# Altium schematic sheet Schematic1.SchDoc
size A0; SheetNumber: 1; SheetTotal: 1
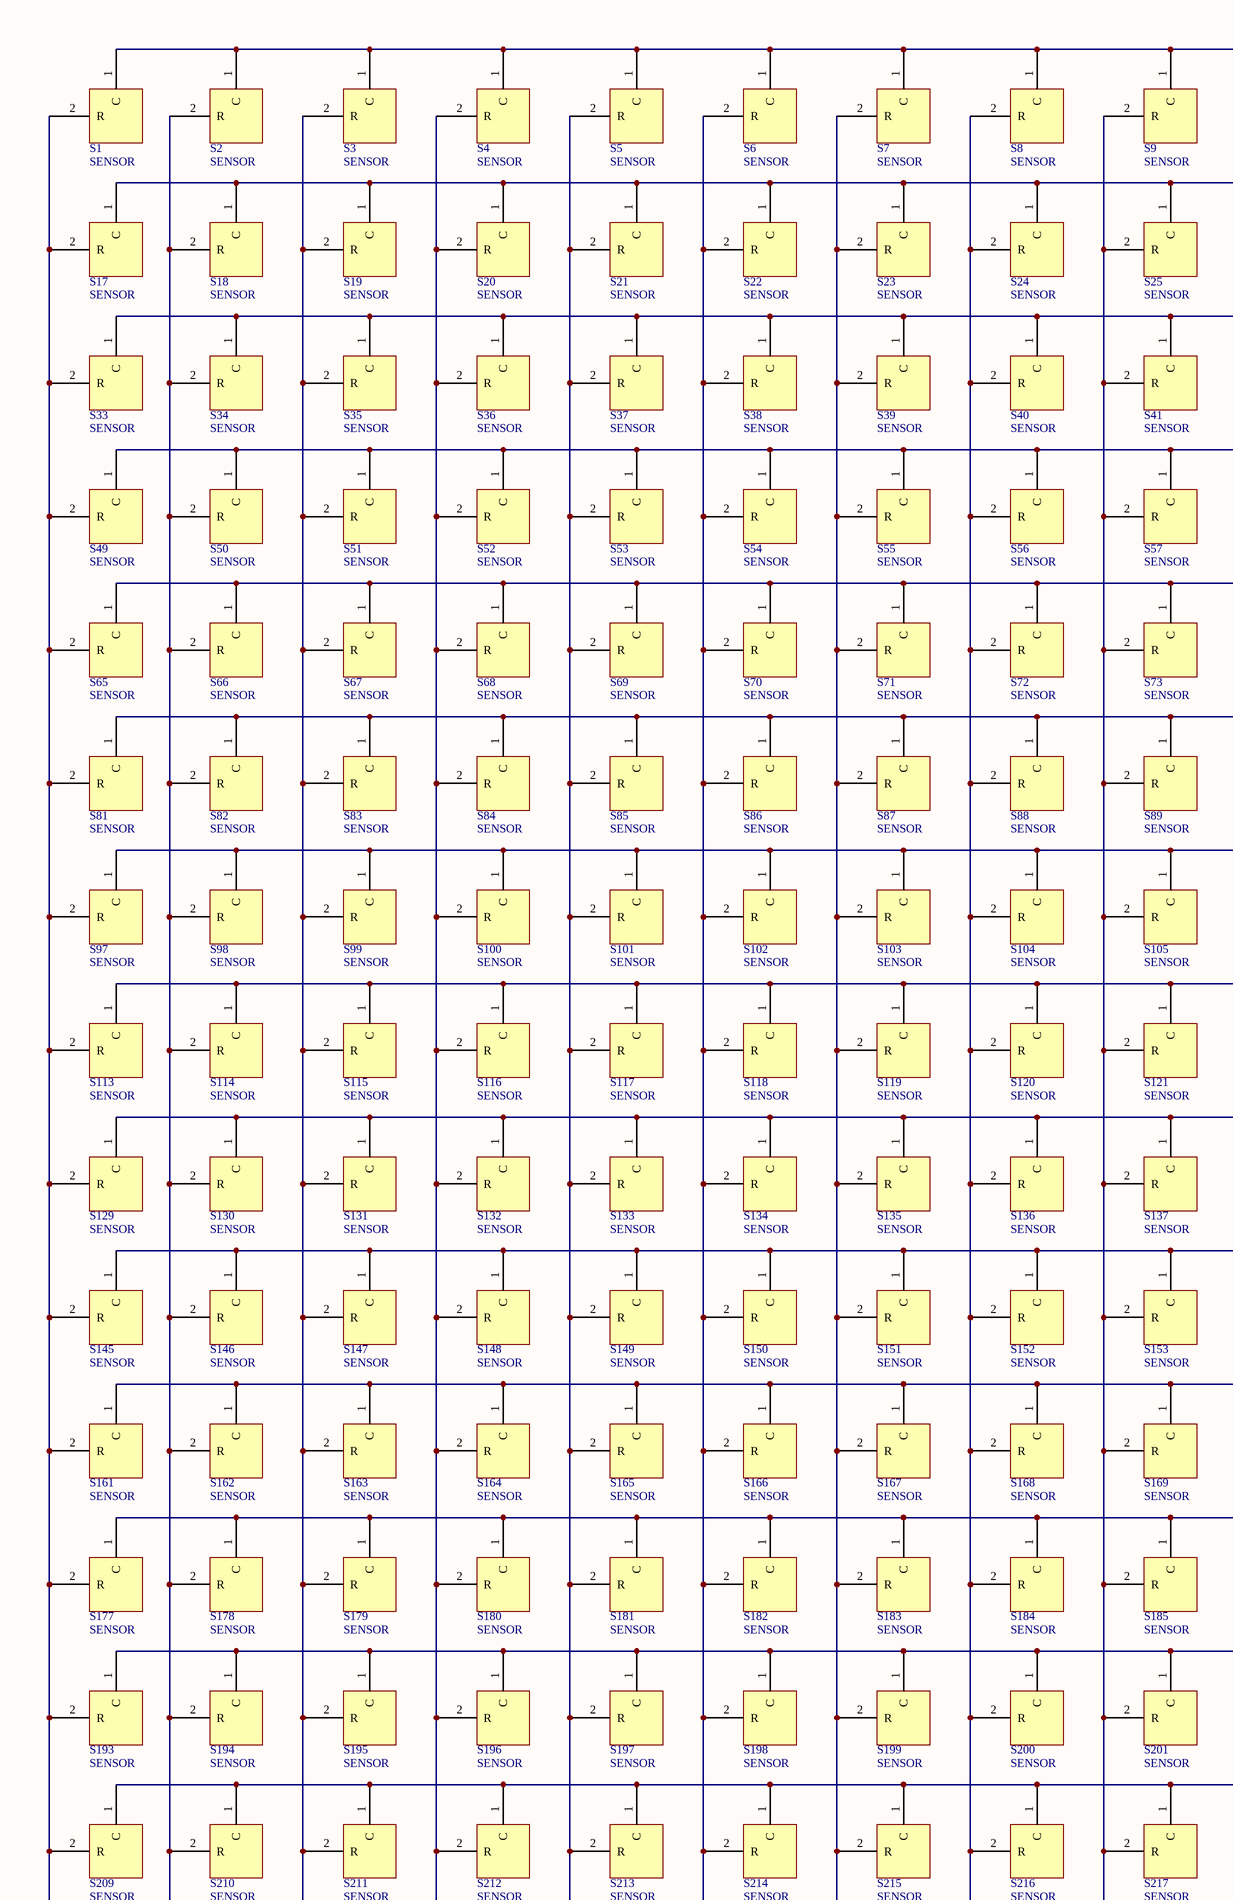
[diagram p0: Schematic1.SchDoc, top left]
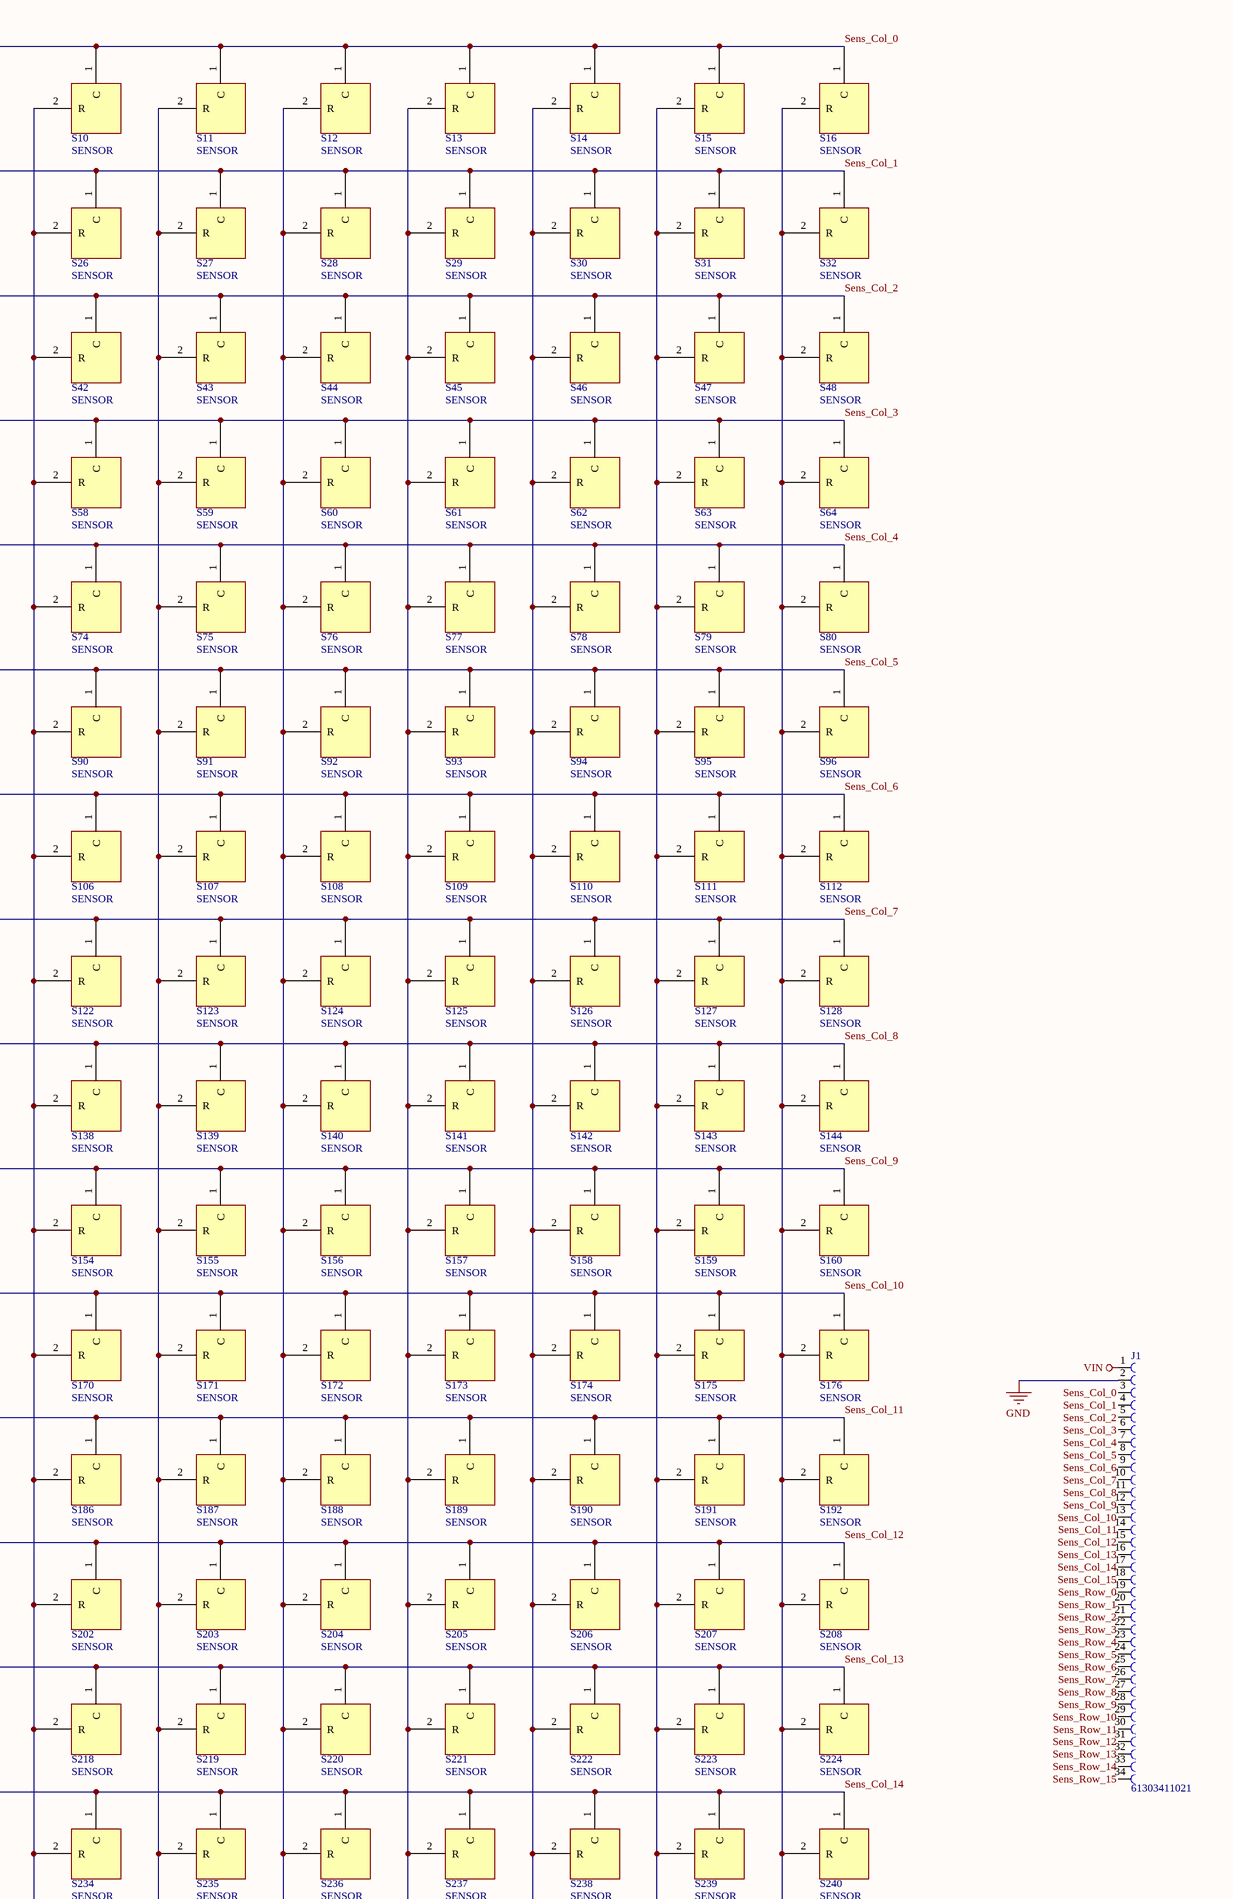
[diagram p1: Schematic1.SchDoc, top right]
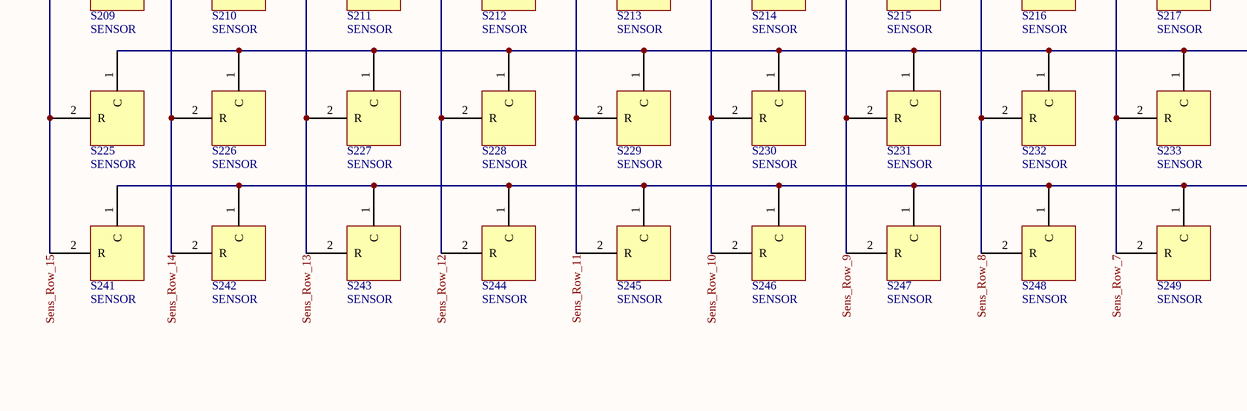
[diagram p2: Schematic1.SchDoc, bottom left]
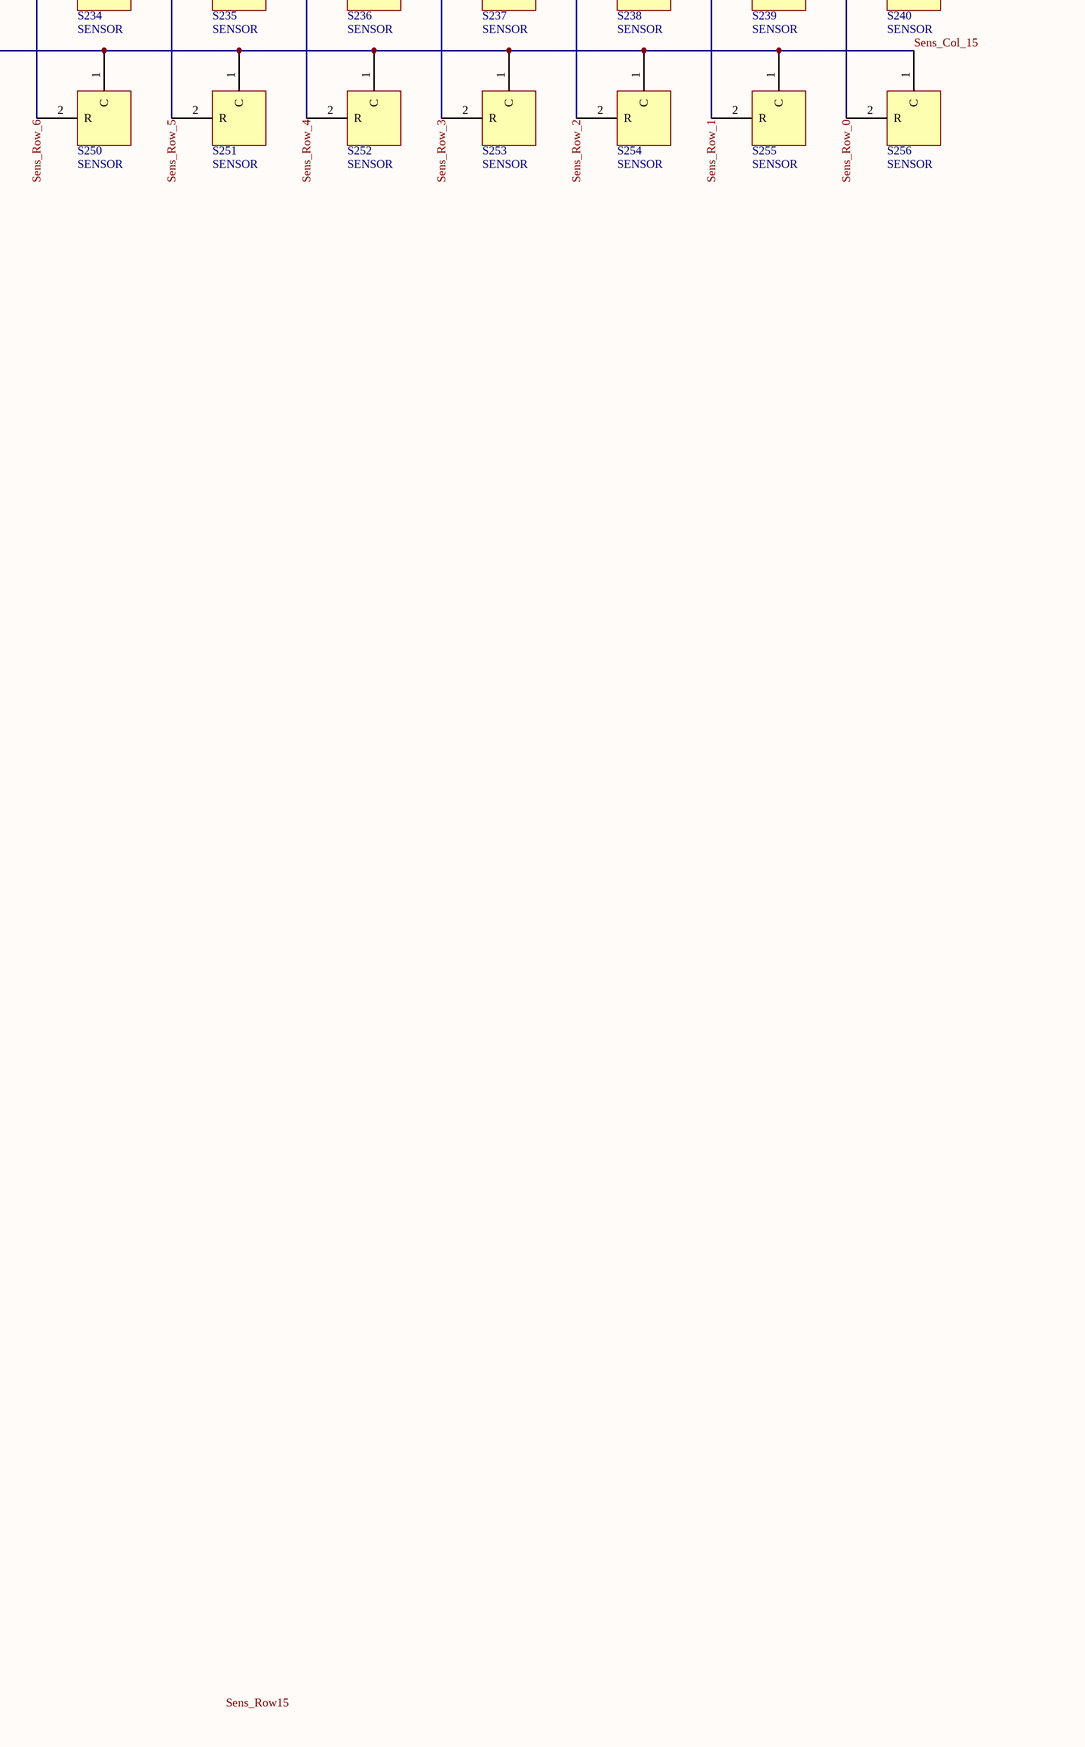
[diagram p3: Schematic1.SchDoc, bottom right]

## Parts
J1  61303411021  [61303411021]
S1  SENSOR  [SENSOR]
S2  SENSOR  [SENSOR]
S3  SENSOR  [SENSOR]
S4  SENSOR  [SENSOR]
S5  SENSOR  [SENSOR]
S6  SENSOR  [SENSOR]
S7  SENSOR  [SENSOR]
S8  SENSOR  [SENSOR]
S9  SENSOR  [SENSOR]
S10  SENSOR  [SENSOR]
S11  SENSOR  [SENSOR]
S12  SENSOR  [SENSOR]
S13  SENSOR  [SENSOR]
S14  SENSOR  [SENSOR]
S15  SENSOR  [SENSOR]
S16  SENSOR  [SENSOR]
S17  SENSOR  [SENSOR]
S18  SENSOR  [SENSOR]
S19  SENSOR  [SENSOR]
S20  SENSOR  [SENSOR]
S21  SENSOR  [SENSOR]
S22  SENSOR  [SENSOR]
S23  SENSOR  [SENSOR]
S24  SENSOR  [SENSOR]
S25  SENSOR  [SENSOR]
S26  SENSOR  [SENSOR]
S27  SENSOR  [SENSOR]
S28  SENSOR  [SENSOR]
S29  SENSOR  [SENSOR]
S30  SENSOR  [SENSOR]
S31  SENSOR  [SENSOR]
S32  SENSOR  [SENSOR]
S33  SENSOR  [SENSOR]
S34  SENSOR  [SENSOR]
S35  SENSOR  [SENSOR]
S36  SENSOR  [SENSOR]
S37  SENSOR  [SENSOR]
S38  SENSOR  [SENSOR]
S39  SENSOR  [SENSOR]
S40  SENSOR  [SENSOR]
S41  SENSOR  [SENSOR]
S42  SENSOR  [SENSOR]
S43  SENSOR  [SENSOR]
S44  SENSOR  [SENSOR]
S45  SENSOR  [SENSOR]
S46  SENSOR  [SENSOR]
S47  SENSOR  [SENSOR]
S48  SENSOR  [SENSOR]
S49  SENSOR  [SENSOR]
S50  SENSOR  [SENSOR]
S51  SENSOR  [SENSOR]
S52  SENSOR  [SENSOR]
S53  SENSOR  [SENSOR]
S54  SENSOR  [SENSOR]
S55  SENSOR  [SENSOR]
S56  SENSOR  [SENSOR]
S57  SENSOR  [SENSOR]
S58  SENSOR  [SENSOR]
S59  SENSOR  [SENSOR]
S60  SENSOR  [SENSOR]
S61  SENSOR  [SENSOR]
S62  SENSOR  [SENSOR]
S63  SENSOR  [SENSOR]
S64  SENSOR  [SENSOR]
S65  SENSOR  [SENSOR]
S66  SENSOR  [SENSOR]
S67  SENSOR  [SENSOR]
S68  SENSOR  [SENSOR]
S69  SENSOR  [SENSOR]
S70  SENSOR  [SENSOR]
S71  SENSOR  [SENSOR]
S72  SENSOR  [SENSOR]
S73  SENSOR  [SENSOR]
S74  SENSOR  [SENSOR]
S75  SENSOR  [SENSOR]
S76  SENSOR  [SENSOR]
S77  SENSOR  [SENSOR]
S78  SENSOR  [SENSOR]
S79  SENSOR  [SENSOR]
S80  SENSOR  [SENSOR]
S81  SENSOR  [SENSOR]
S82  SENSOR  [SENSOR]
S83  SENSOR  [SENSOR]
S84  SENSOR  [SENSOR]
S85  SENSOR  [SENSOR]
S86  SENSOR  [SENSOR]
S87  SENSOR  [SENSOR]
S88  SENSOR  [SENSOR]
S89  SENSOR  [SENSOR]
S90  SENSOR  [SENSOR]
S91  SENSOR  [SENSOR]
S92  SENSOR  [SENSOR]
S93  SENSOR  [SENSOR]
S94  SENSOR  [SENSOR]
S95  SENSOR  [SENSOR]
S96  SENSOR  [SENSOR]
S97  SENSOR  [SENSOR]
S98  SENSOR  [SENSOR]
S99  SENSOR  [SENSOR]
S100  SENSOR  [SENSOR]
S101  SENSOR  [SENSOR]
S102  SENSOR  [SENSOR]
S103  SENSOR  [SENSOR]
S104  SENSOR  [SENSOR]
S105  SENSOR  [SENSOR]
S106  SENSOR  [SENSOR]
S107  SENSOR  [SENSOR]
S108  SENSOR  [SENSOR]
S109  SENSOR  [SENSOR]
S110  SENSOR  [SENSOR]
S111  SENSOR  [SENSOR]
S112  SENSOR  [SENSOR]
S113  SENSOR  [SENSOR]
S114  SENSOR  [SENSOR]
S115  SENSOR  [SENSOR]
S116  SENSOR  [SENSOR]
S117  SENSOR  [SENSOR]
S118  SENSOR  [SENSOR]
S119  SENSOR  [SENSOR]
S120  SENSOR  [SENSOR]
S121  SENSOR  [SENSOR]
S122  SENSOR  [SENSOR]
S123  SENSOR  [SENSOR]
S124  SENSOR  [SENSOR]
S125  SENSOR  [SENSOR]
S126  SENSOR  [SENSOR]
S127  SENSOR  [SENSOR]
S128  SENSOR  [SENSOR]
S129  SENSOR  [SENSOR]
S130  SENSOR  [SENSOR]
S131  SENSOR  [SENSOR]
S132  SENSOR  [SENSOR]
S133  SENSOR  [SENSOR]
S134  SENSOR  [SENSOR]
S135  SENSOR  [SENSOR]
S136  SENSOR  [SENSOR]
S137  SENSOR  [SENSOR]
S138  SENSOR  [SENSOR]
S139  SENSOR  [SENSOR]
S140  SENSOR  [SENSOR]
S141  SENSOR  [SENSOR]
S142  SENSOR  [SENSOR]
S143  SENSOR  [SENSOR]
S144  SENSOR  [SENSOR]
S145  SENSOR  [SENSOR]
S146  SENSOR  [SENSOR]
S147  SENSOR  [SENSOR]
S148  SENSOR  [SENSOR]
S149  SENSOR  [SENSOR]
S150  SENSOR  [SENSOR]
S151  SENSOR  [SENSOR]
S152  SENSOR  [SENSOR]
S153  SENSOR  [SENSOR]
S154  SENSOR  [SENSOR]
S155  SENSOR  [SENSOR]
S156  SENSOR  [SENSOR]
S157  SENSOR  [SENSOR]
S158  SENSOR  [SENSOR]
S159  SENSOR  [SENSOR]
S160  SENSOR  [SENSOR]
S161  SENSOR  [SENSOR]
S162  SENSOR  [SENSOR]
S163  SENSOR  [SENSOR]
S164  SENSOR  [SENSOR]
S165  SENSOR  [SENSOR]
S166  SENSOR  [SENSOR]
S167  SENSOR  [SENSOR]
S168  SENSOR  [SENSOR]
S169  SENSOR  [SENSOR]
S170  SENSOR  [SENSOR]
S171  SENSOR  [SENSOR]
S172  SENSOR  [SENSOR]
S173  SENSOR  [SENSOR]
S174  SENSOR  [SENSOR]
S175  SENSOR  [SENSOR]
S176  SENSOR  [SENSOR]
S177  SENSOR  [SENSOR]
S178  SENSOR  [SENSOR]
S179  SENSOR  [SENSOR]
S180  SENSOR  [SENSOR]
S181  SENSOR  [SENSOR]
S182  SENSOR  [SENSOR]
S183  SENSOR  [SENSOR]
S184  SENSOR  [SENSOR]
S185  SENSOR  [SENSOR]
S186  SENSOR  [SENSOR]
S187  SENSOR  [SENSOR]
S188  SENSOR  [SENSOR]
S189  SENSOR  [SENSOR]
S190  SENSOR  [SENSOR]
S191  SENSOR  [SENSOR]
S192  SENSOR  [SENSOR]
S193  SENSOR  [SENSOR]
S194  SENSOR  [SENSOR]
S195  SENSOR  [SENSOR]
S196  SENSOR  [SENSOR]
S197  SENSOR  [SENSOR]
S198  SENSOR  [SENSOR]
S199  SENSOR  [SENSOR]
S200  SENSOR  [SENSOR]
S201  SENSOR  [SENSOR]
S202  SENSOR  [SENSOR]
S203  SENSOR  [SENSOR]
S204  SENSOR  [SENSOR]
S205  SENSOR  [SENSOR]
S206  SENSOR  [SENSOR]
S207  SENSOR  [SENSOR]
S208  SENSOR  [SENSOR]
S209  SENSOR  [SENSOR]
S210  SENSOR  [SENSOR]
S211  SENSOR  [SENSOR]
S212  SENSOR  [SENSOR]
S213  SENSOR  [SENSOR]
S214  SENSOR  [SENSOR]
S215  SENSOR  [SENSOR]
S216  SENSOR  [SENSOR]
S217  SENSOR  [SENSOR]
S218  SENSOR  [SENSOR]
S219  SENSOR  [SENSOR]
S220  SENSOR  [SENSOR]
S221  SENSOR  [SENSOR]
S222  SENSOR  [SENSOR]
S223  SENSOR  [SENSOR]
S224  SENSOR  [SENSOR]
S225  SENSOR  [SENSOR]
S226  SENSOR  [SENSOR]
S227  SENSOR  [SENSOR]
S228  SENSOR  [SENSOR]
S229  SENSOR  [SENSOR]
S230  SENSOR  [SENSOR]
S231  SENSOR  [SENSOR]
S232  SENSOR  [SENSOR]
S233  SENSOR  [SENSOR]
S234  SENSOR  [SENSOR]
S235  SENSOR  [SENSOR]
S236  SENSOR  [SENSOR]
S237  SENSOR  [SENSOR]
S238  SENSOR  [SENSOR]
S239  SENSOR  [SENSOR]
S240  SENSOR  [SENSOR]
S241  SENSOR  [SENSOR]
S242  SENSOR  [SENSOR]
S243  SENSOR  [SENSOR]
S244  SENSOR  [SENSOR]
S245  SENSOR  [SENSOR]
S246  SENSOR  [SENSOR]
S247  SENSOR  [SENSOR]
S248  SENSOR  [SENSOR]
S249  SENSOR  [SENSOR]
S250  SENSOR  [SENSOR]
S251  SENSOR  [SENSOR]
S252  SENSOR  [SENSOR]
S253  SENSOR  [SENSOR]
S254  SENSOR  [SENSOR]
S255  SENSOR  [SENSOR]
S256  SENSOR  [SENSOR]

## Nets
GND: J1.2
VIN: J1.1
Sens_Col_0: J1.3 S1.1(C) S2.1(C) S3.1(C) S4.1(C) S5.1(C) S6.1(C) S7.1(C) S8.1(C) S9.1(C) S10.1(C) S11.1(C) S12.1(C) S13.1(C) S14.1(C) S15.1(C) S16.1(C)
Sens_Col_1: J1.4 S17.1(C) S18.1(C) S19.1(C) S20.1(C) S21.1(C) S22.1(C) S23.1(C) S24.1(C) S25.1(C) S26.1(C) S27.1(C) S28.1(C) S29.1(C) S30.1(C) S31.1(C) S32.1(C)
Sens_Col_2: J1.5 S33.1(C) S34.1(C) S35.1(C) S36.1(C) S37.1(C) S38.1(C) S39.1(C) S40.1(C) S41.1(C) S42.1(C) S43.1(C) S44.1(C) S45.1(C) S46.1(C) S47.1(C) S48.1(C)
Sens_Col_3: J1.6 S49.1(C) S50.1(C) S51.1(C) S52.1(C) S53.1(C) S54.1(C) S55.1(C) S56.1(C) S57.1(C) S58.1(C) S59.1(C) S60.1(C) S61.1(C) S62.1(C) S63.1(C) S64.1(C)
Sens_Col_4: J1.7 S65.1(C) S66.1(C) S67.1(C) S68.1(C) S69.1(C) S70.1(C) S71.1(C) S72.1(C) S73.1(C) S74.1(C) S75.1(C) S76.1(C) S77.1(C) S78.1(C) S79.1(C) S80.1(C)
Sens_Col_5: J1.8 S81.1(C) S82.1(C) S83.1(C) S84.1(C) S85.1(C) S86.1(C) S87.1(C) S88.1(C) S89.1(C) S90.1(C) S91.1(C) S92.1(C) S93.1(C) S94.1(C) S95.1(C) S96.1(C)
Sens_Col_6: J1.9 S97.1(C) S98.1(C) S99.1(C) S100.1(C) S101.1(C) S102.1(C) S103.1(C) S104.1(C) S105.1(C) S106.1(C) S107.1(C) S108.1(C) S109.1(C) S110.1(C) S111.1(C) S112.1(C)
Sens_Col_7: J1.10 S113.1(C) S114.1(C) S115.1(C) S116.1(C) S117.1(C) S118.1(C) S119.1(C) S120.1(C) S121.1(C) S122.1(C) S123.1(C) S124.1(C) S125.1(C) S126.1(C) S127.1(C) S128.1(C)
Sens_Col_8: J1.11 S129.1(C) S130.1(C) S131.1(C) S132.1(C) S133.1(C) S134.1(C) S135.1(C) S136.1(C) S137.1(C) S138.1(C) S139.1(C) S140.1(C) S141.1(C) S142.1(C) S143.1(C) S144.1(C)
Sens_Col_9: J1.12 S145.1(C) S146.1(C) S147.1(C) S148.1(C) S149.1(C) S150.1(C) S151.1(C) S152.1(C) S153.1(C) S154.1(C) S155.1(C) S156.1(C) S157.1(C) S158.1(C) S159.1(C) S160.1(C)
Sens_Col_10: J1.13 S161.1(C) S162.1(C) S163.1(C) S164.1(C) S165.1(C) S166.1(C) S167.1(C) S168.1(C) S169.1(C) S170.1(C) S171.1(C) S172.1(C) S173.1(C) S174.1(C) S175.1(C) S176.1(C)
Sens_Col_11: J1.14 S177.1(C) S178.1(C) S179.1(C) S180.1(C) S181.1(C) S182.1(C) S183.1(C) S184.1(C) S185.1(C) S186.1(C) S187.1(C) S188.1(C) S189.1(C) S190.1(C) S191.1(C) S192.1(C)
Sens_Col_12: J1.15 S193.1(C) S194.1(C) S195.1(C) S196.1(C) S197.1(C) S198.1(C) S199.1(C) S200.1(C) S201.1(C) S202.1(C) S203.1(C) S204.1(C) S205.1(C) S206.1(C) S207.1(C) S208.1(C)
Sens_Col_13: J1.16 S209.1(C) S210.1(C) S211.1(C) S212.1(C) S213.1(C) S214.1(C) S215.1(C) S216.1(C) S217.1(C) S218.1(C) S219.1(C) S220.1(C) S221.1(C) S222.1(C) S223.1(C) S224.1(C)
Sens_Col_14: J1.17 S225.1(C) S226.1(C) S227.1(C) S228.1(C) S229.1(C) S230.1(C) S231.1(C) S232.1(C) S233.1(C) S234.1(C) S235.1(C) S236.1(C) S237.1(C) S238.1(C) S239.1(C) S240.1(C)
Sens_Col_15: J1.18 S241.1(C) S242.1(C) S243.1(C) S244.1(C) S245.1(C) S246.1(C) S247.1(C) S248.1(C) S249.1(C) S250.1(C) S251.1(C) S252.1(C) S253.1(C) S254.1(C) S255.1(C) S256.1(C)
Sens_Row_0: J1.19 S16.2(R) S32.2(R) S48.2(R) S64.2(R) S80.2(R) S96.2(R) S112.2(R) S128.2(R) S144.2(R) S160.2(R) S176.2(R) S192.2(R) S208.2(R) S224.2(R) S240.2(R) S256.2(R)
Sens_Row_1: J1.20 S15.2(R) S31.2(R) S47.2(R) S63.2(R) S79.2(R) S95.2(R) S111.2(R) S127.2(R) S143.2(R) S159.2(R) S175.2(R) S191.2(R) S207.2(R) S223.2(R) S239.2(R) S255.2(R)
Sens_Row_2: J1.21 S14.2(R) S30.2(R) S46.2(R) S62.2(R) S78.2(R) S94.2(R) S110.2(R) S126.2(R) S142.2(R) S158.2(R) S174.2(R) S190.2(R) S206.2(R) S222.2(R) S238.2(R) S254.2(R)
Sens_Row_3: J1.22 S13.2(R) S29.2(R) S45.2(R) S61.2(R) S77.2(R) S93.2(R) S109.2(R) S125.2(R) S141.2(R) S157.2(R) S173.2(R) S189.2(R) S205.2(R) S221.2(R) S237.2(R) S253.2(R)
Sens_Row_4: J1.23 S12.2(R) S28.2(R) S44.2(R) S60.2(R) S76.2(R) S92.2(R) S108.2(R) S124.2(R) S140.2(R) S156.2(R) S172.2(R) S188.2(R) S204.2(R) S220.2(R) S236.2(R) S252.2(R)
Sens_Row_5: J1.24 S11.2(R) S27.2(R) S43.2(R) S59.2(R) S75.2(R) S91.2(R) S107.2(R) S123.2(R) S139.2(R) S155.2(R) S171.2(R) S187.2(R) S203.2(R) S219.2(R) S235.2(R) S251.2(R)
Sens_Row_6: J1.25 S10.2(R) S26.2(R) S42.2(R) S58.2(R) S74.2(R) S90.2(R) S106.2(R) S122.2(R) S138.2(R) S154.2(R) S170.2(R) S186.2(R) S202.2(R) S218.2(R) S234.2(R) S250.2(R)
Sens_Row_7: J1.26 S9.2(R) S25.2(R) S41.2(R) S57.2(R) S73.2(R) S89.2(R) S105.2(R) S121.2(R) S137.2(R) S153.2(R) S169.2(R) S185.2(R) S201.2(R) S217.2(R) S233.2(R) S249.2(R)
Sens_Row_8: J1.27 S8.2(R) S24.2(R) S40.2(R) S56.2(R) S72.2(R) S88.2(R) S104.2(R) S120.2(R) S136.2(R) S152.2(R) S168.2(R) S184.2(R) S200.2(R) S216.2(R) S232.2(R) S248.2(R)
Sens_Row_9: J1.28 S7.2(R) S23.2(R) S39.2(R) S55.2(R) S71.2(R) S87.2(R) S103.2(R) S119.2(R) S135.2(R) S151.2(R) S167.2(R) S183.2(R) S199.2(R) S215.2(R) S231.2(R) S247.2(R)
Sens_Row_10: J1.29 S6.2(R) S22.2(R) S38.2(R) S54.2(R) S70.2(R) S86.2(R) S102.2(R) S118.2(R) S134.2(R) S150.2(R) S166.2(R) S182.2(R) S198.2(R) S214.2(R) S230.2(R) S246.2(R)
Sens_Row_11: J1.30 S5.2(R) S21.2(R) S37.2(R) S53.2(R) S69.2(R) S85.2(R) S101.2(R) S117.2(R) S133.2(R) S149.2(R) S165.2(R) S181.2(R) S197.2(R) S213.2(R) S229.2(R) S245.2(R)
Sens_Row_12: J1.31 S4.2(R) S20.2(R) S36.2(R) S52.2(R) S68.2(R) S84.2(R) S100.2(R) S116.2(R) S132.2(R) S148.2(R) S164.2(R) S180.2(R) S196.2(R) S212.2(R) S228.2(R) S244.2(R)
Sens_Row_13: J1.32 S3.2(R) S19.2(R) S35.2(R) S51.2(R) S67.2(R) S83.2(R) S99.2(R) S115.2(R) S131.2(R) S147.2(R) S163.2(R) S179.2(R) S195.2(R) S211.2(R) S227.2(R) S243.2(R)
Sens_Row_14: J1.33 S2.2(R) S18.2(R) S34.2(R) S50.2(R) S66.2(R) S82.2(R) S98.2(R) S114.2(R) S130.2(R) S146.2(R) S162.2(R) S178.2(R) S194.2(R) S210.2(R) S226.2(R) S242.2(R)
Sens_Row_15: J1.34 S1.2(R) S17.2(R) S33.2(R) S49.2(R) S65.2(R) S81.2(R) S97.2(R) S113.2(R) S129.2(R) S145.2(R) S161.2(R) S177.2(R) S193.2(R) S209.2(R) S225.2(R) S241.2(R)

## Notes on the sheet
- Labels drawn without touching a wire or pin: Sens_Row15

## Library data of the parts
J1 = 61303411021: <b> WR-PHD 2.54mm Angled Pin Header, 34 Pins/<b>=>Con_BTB_PHD_2.54_1_THT_61303411021 <br><a href="http://katalog.we-online.de/media/images/eican/Con_BTB_PHD_2.54_1_THT_61303211021_pf2.jpg" title="Enlarge picture"> <img src="http://katalog.we-online.de/media/thumbs2/eican/thb_Con_BTB_PHD_2.54_1_THT_61303211021_pf2.jpg" width="320"></a><p> Details see: <a href="http://katalog.we-online.de/en/em/613_0xx_110_21">http://katalog.we-online.de/en/em/613_0xx_110_21</a><p> Created 2014-05-29, Karrer Zheng<br> 2014 (C) WÃ¼rth Elektronik; MF: {'manufacturer': u'W\xfcrth Elektronik'}; Value: *; MP: 61303411021; Package: None; Availability: Unavailable; Price: None